# Altium schematic sheet battery_module.SchDoc
size A4
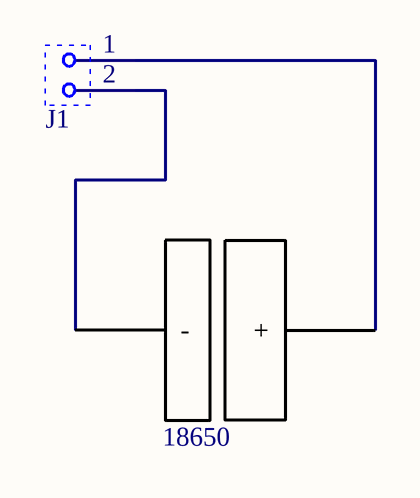
[diagram p0: battery_module.SchDoc]

## Parts
18650  18650_cell  [PCBComponent_1]  (value not drawn)
J1  Molex Microfit  [MICROFIT 1x2 Vertical]  (value not drawn)

## Nets
Net18650_0: 18650.0(-) J1.2
Net18650_1: 18650.1(+) J1.1

## Library data of the parts
18650 = 18650_cell: pin to pad: 0>1 1>2
J1 = Microfit 2x1: Symbol: Molex 430450212; Supplier: TME